# Altium schematic sheet Load_Cell_Biasing.SchDoc
size A3; Organization: Altium Limited; Address1: L3, 12a Rodborough Rd; Address2: Frenchs Forest; Address3: NSW; Address4: Australia 2086; DocumentNumber: 3; SheetNumber: 3; SheetTotal: 8
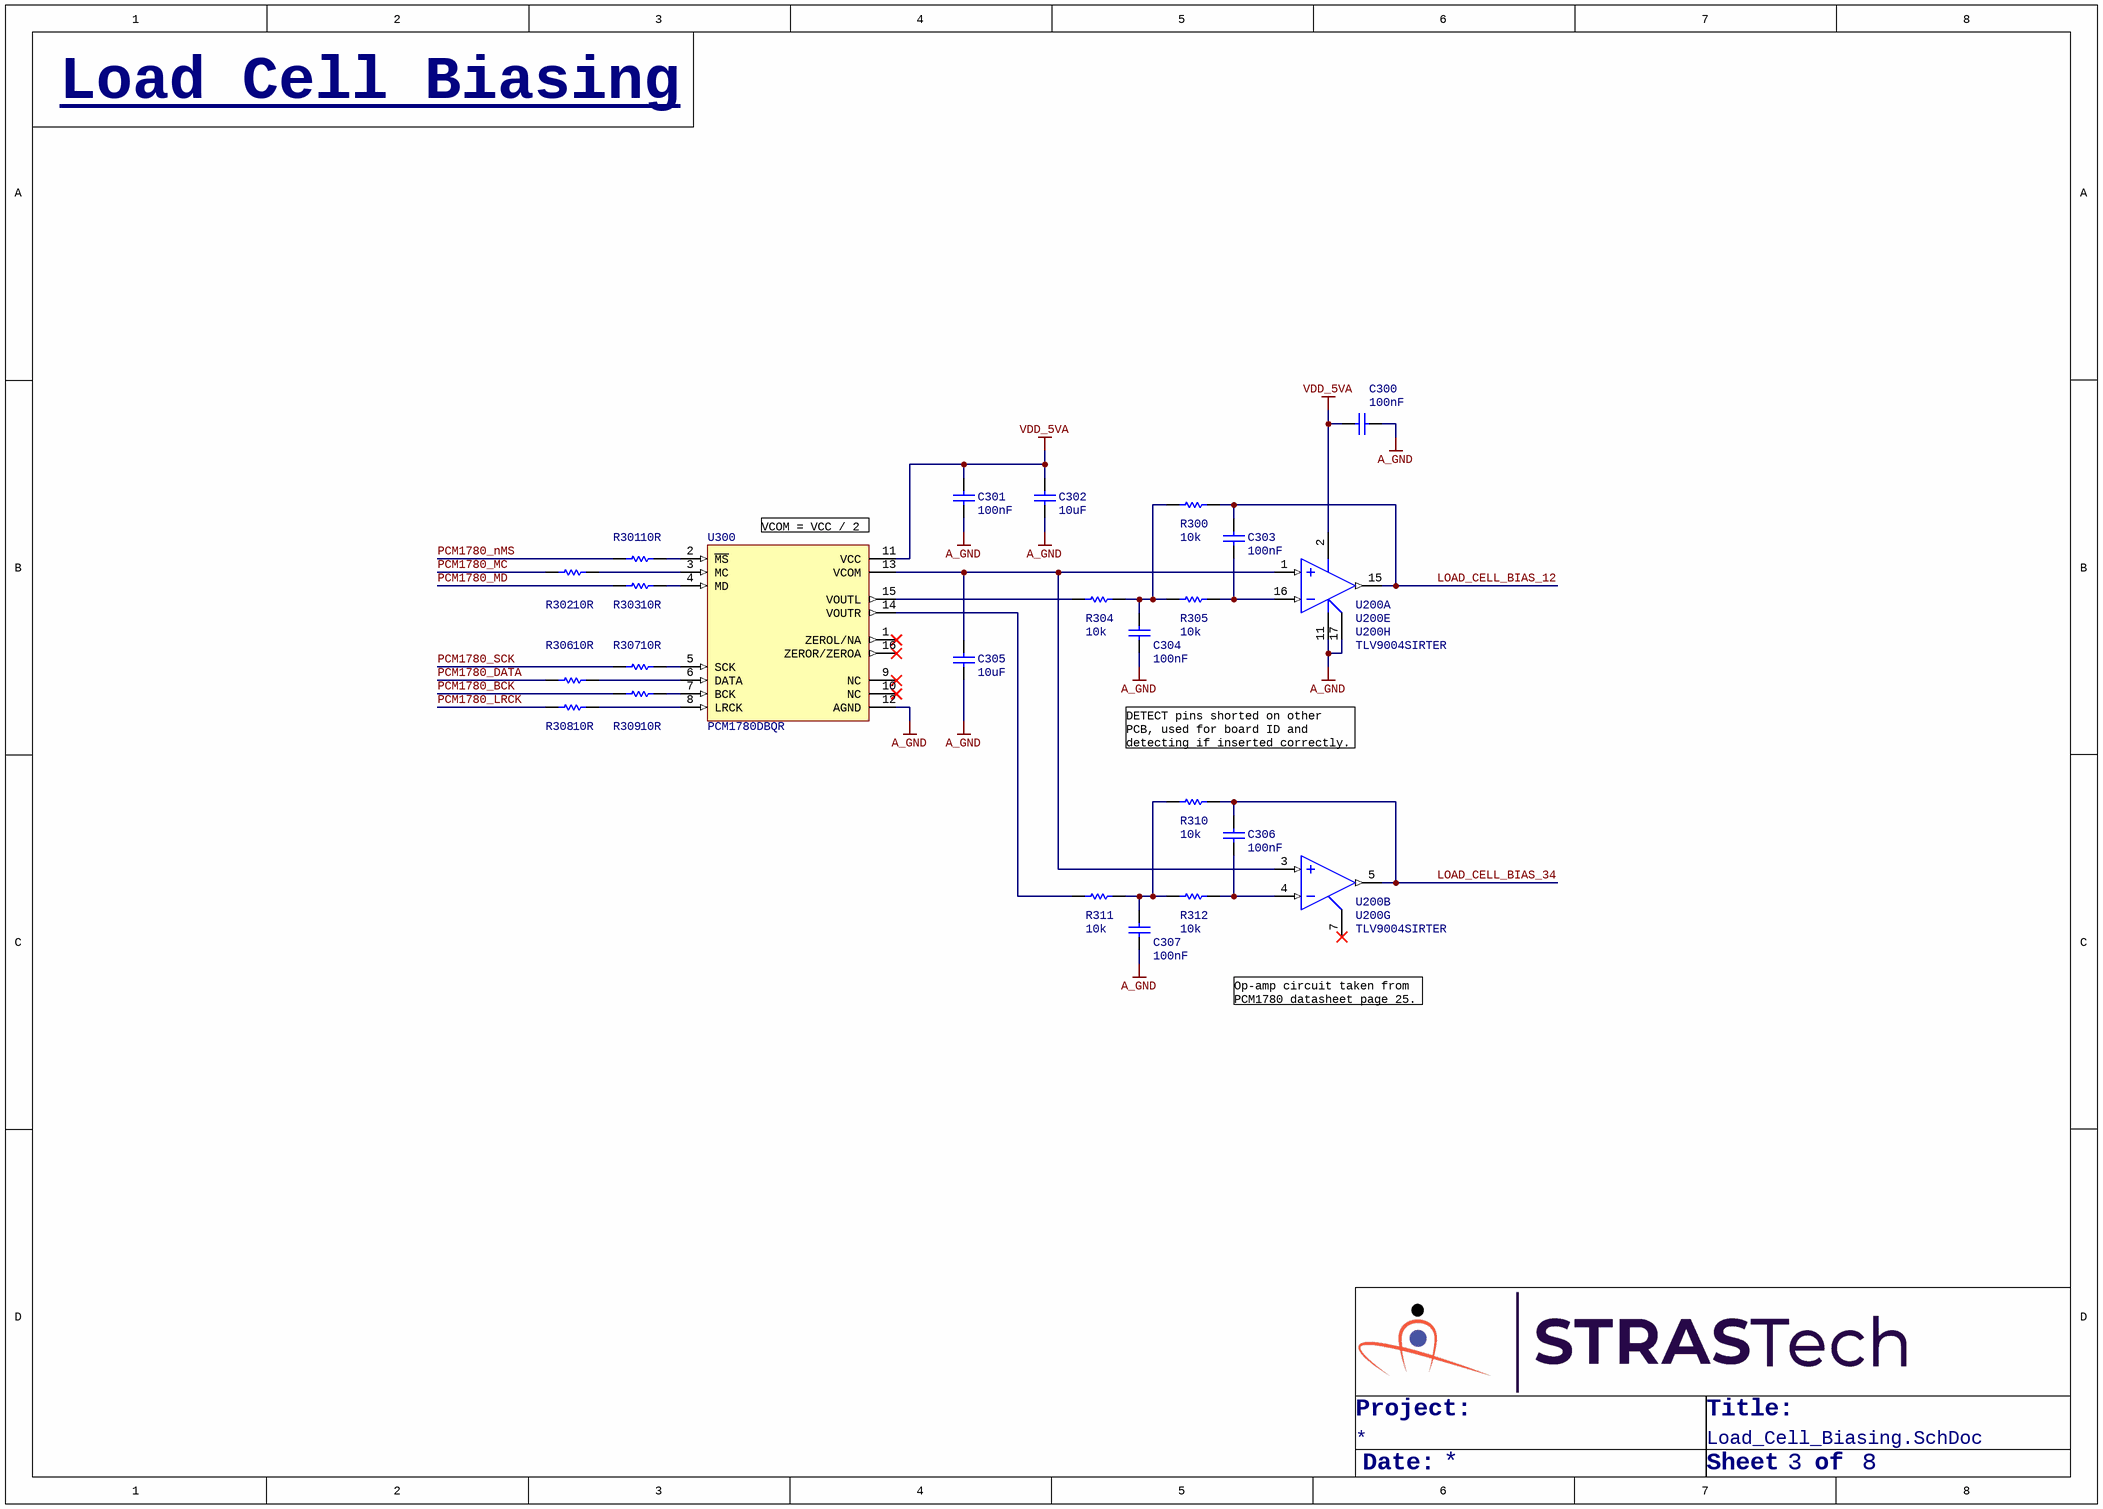
[diagram p0: Load_Cell_Biasing.SchDoc]

## Parts
C300  100nF  [Cap,SMD,0402]
C301  100nF  [Cap,SMD,0402]
C302  10uF  [Cap,SMD,0402]
C303  100nF  [Cap,SMD,0402]
C304  100nF  [Cap,SMD,0402]
C305  10uF  [Cap,SMD,0402]
C306  100nF  [Cap,SMD,0402]
C307  100nF  [Cap,SMD,0402]
R300  10k  [RES,0402]
R301  10R  [RES,0402]
R302  10R  [RES,0402]
R303  10R  [RES,0402]
R304  10k  [RES,0402]
R305  10k  [RES,0402]
R306  10R  [RES,0402]
R307  10R  [RES,0402]
R308  10R  [RES,0402]
R309  10R  [RES,0402]
R310  10k  [RES,0402]
R311  10k  [RES,0402]
R312  10k  [RES,0402]
U200  TLV9004SIRTER  [IC,QFN-16,3x3]  (parts A,B,E,G,H of 8)
U300  PCM1780DBQR  [IC,TSSOP-16,W3.9,P0.635MM]

## Nets
A_GND: C300.1 C301.1 C302.1 C304.1 C305.2 C307.1 U200.11(V-) U200.17(PAD) U300.12(AGND)
VDD_5VA: C300.2 C301.2 C302.2 U200.2(V+) U300.11(VCC)
LOAD_CELL_BIAS_12: C303.2 R300.1 U200.15(OUT1)
LOAD_CELL_BIAS_34: C306.2 R310.1 U200.5(OUT2)
PCM1780_BCK: R309.1
PCM1780_DATA: R306.1
PCM1780_LRCK: R308.1
PCM1780_MC: R302.1
PCM1780_MD: R303.1
PCM1780_nMS: R301.1
PCM1780_SCK: R307.1
NetC303_1: C303.1 R305.2 U200.16(IN1-)
NetC304_2: C304.2 R300.2 R304.2 R305.1
NetC305_1: C305.1 U200.1(IN1+) U200.3(IN2+) U300.13(VCOM)
NetC306_1: C306.1 R312.2 U200.4(IN2-)
NetC307_2: C307.2 R310.2 R311.2 R312.1
NetR301_2: R301.2 U300.2(~{MS})
NetR302_2: R302.2 U300.3(MC)
NetR303_2: R303.2 U300.4(MD)
NetR304_1: R304.1 U300.15(VOUTL)
NetR306_2: R306.2 U300.6(DATA)
NetR307_2: R307.2 U300.5(SCK)
NetR308_2: R308.2 U300.8(LRCK)
NetR309_2: R309.2 U300.7(BCK)
NetR311_1: R311.1 U300.14(VOUTR)

Not connected (* = marked no-connect by the designer): U200 7(~{SHDN}34)*; U300 1(ZEROL/NA)* 9(NC)* 10(NC)* 16(ZEROR/ZEROA)*

## Notes on the sheet
- Load Cell Biasing
- (near U300) VCOM = VCC / 2
- DETECT pins shorted on other PCB, used for board ID and detecting if inserted correctly.
- Op-amp circuit taken from PCM1780 datasheet page 25.
- Project:
- Title:
- Date:
- Sheet
- of
- Title
- Size:
- A3
- Revision:
- Design By:

## Library data of the parts
C300 C301 C303 C304 C306 C307 = CAP,Cer,100nF,25VDC,X7R,0402: 0.1µF ±10% 25V Ceramic Capacitor X7R 0402 (1005 Metric); Vendor Part Number: 490-14603-1-ND; Manufacturer: Murata Electronics; Manufacturer Part Number: GRM155R71E104KE14J; Vendor: Digikey; HelpURL: https://search.murata.co.jp/Ceramy/image/img/A01X/G101/ENG/GRM155R71E104KE14-01.pdf; CreatedBy: Judd Foster
C302 C305 = CAP,Cer,10uF,10VDC,X5R,0402: 10 µF ±20% 10V Ceramic Capacitor X5R 0402 (1005 Metric); Vendor Part Number: 1276-1450-1-ND; Manufacturer: Samsung Electro-Mechanics; Manufacturer Part Number: CL05A106MP5NUNC; Vendor: Digikey; HelpURL: https://media.digikey.com/pdf/Data%20Sheets/Samsung%20PDFs/CL05A106MP5NUNC_Spec.pdf; CreatedBy: Judd Foster
R300 R304 R305 R310-R312 = RES,10k,5%,0.063W,0402: 10 kOhms ±5% 0.063W, 1/16W Chip Resistor 0402 (1005 Metric) Automotive AEC-Q200 Thick Film; Vendor Part Number: RMCF0402JT10K0CT-ND; Manufacturer: Stackpole Electronics Inc; Manufacturer Part Number: RMCF0402JT10K0; Vendor: DIgikey; HelpURL: https://www.seielect.com/catalog/sei-rmcf_rmcp.pdf; CreatedBy: Judd Foster
R301-R303 R306-R309 = RES,10R,1%,0.063W,0402: 10 Ohms ±1% 0.063W, 1/16W Chip Resistor 0402 (1005 Metric) Automotive AEC-Q200 Thick Film; Manufacturer: Panasonic Electronic Components; Manufacturer Part Number: ERJ-2RKF10R0X; Vendor Part Number: P10.0LCT-ND; Vendor: Digikey; CreatedBy: Judd Foster; HelpURL: https://industrial.panasonic.com/cdbs/www-data/pdf/RDA0000/AOA0000C304.pdf
U200 = TLV9004SIRTER: General Purpose Amplifier 4 Circuit Rail-to-Rail 16-WQFN (3x3); Manufacturer: Texas Instruments; Vendor Part Number: 296-51829-1-ND; Vendor: Digikey; CreatedBy: Judd Foster; HelpURL: https://www.ti.com/general/docs/suppproductinfo.tsp?distId=10&gotoUrl=https%3A%2F%2Fwww.ti.com%2Flit%2Fgpn%2Ftlv9004; Manufacturer Part Number: TLV9004SIRTER
U300 = PCM1780DBQR: DAC, Audio 24 b 200k I²S 16-SSOP; Manufacturer: Texas Instruments; Vendor Part Number: 296-41373-1-ND; Vendor: Digikey; Manufacturer Part Number: PCM1780DBQR; HelpURL: https://www.ti.com/general/docs/suppproductinfo.tsp?distId=10&gotoUrl=https%3A%2F%2Fwww.ti.com%2Flit%2Fgpn%2Fpcm1780; CreatedBy: Judd Foster